# Altium schematic sheet sdCard.SchDoc
size A4
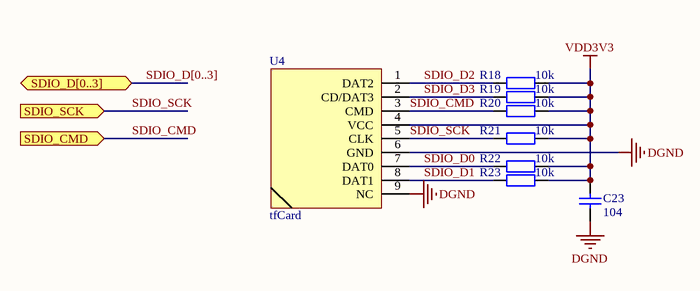
[diagram p0: sdCard.SchDoc]

## Parts
C23  104  [0603_]
R18  10k  [0603_]
R19  10k  [0603_]
R20  10k  [0603_]
R21  10k  [0603_]
R22  10k  [0603_]
R23  10k  [0603_]
U4  tfCard  [tfCard]

## Ports
SDIO_CMD (in), SDIO_D[0..3] (bidir), SDIO_SCK (in)

## Nets
DGND: C23.1 U4.6(GND) U4.9(NC)
VDD3V3: C23.2 R18.2 R19.2 R20.2 R21.2 R22.2 R23.2 U4.4(VCC)
SDIO_CMD: R20.1 U4.3(CMD) ; port SDIO_CMD
SDIO_D0: R22.1 U4.7(DAT0)
SDIO_D1: R23.1 U4.8(DAT1)
SDIO_D2: R18.1 U4.1(DAT2)
SDIO_D3: R19.1 U4.2(CD/DAT3)
SDIO_SCK: R21.1 U4.5(CLK) ; port SDIO_SCK

## Buses and harness runs
bus SDIO_D[0..3] = port SDIO_D[0..3]

## Library data of the parts
C23 = cap: VDC_: 16V; Tolerance_: ±10%
R18-R23 = res: Tolerance_: ±5%; Power_: ?W